# Altium schematic sheet Sensors - RF Module.SchDoc
size A4; SheetNumber: 5; SheetTotal: 5
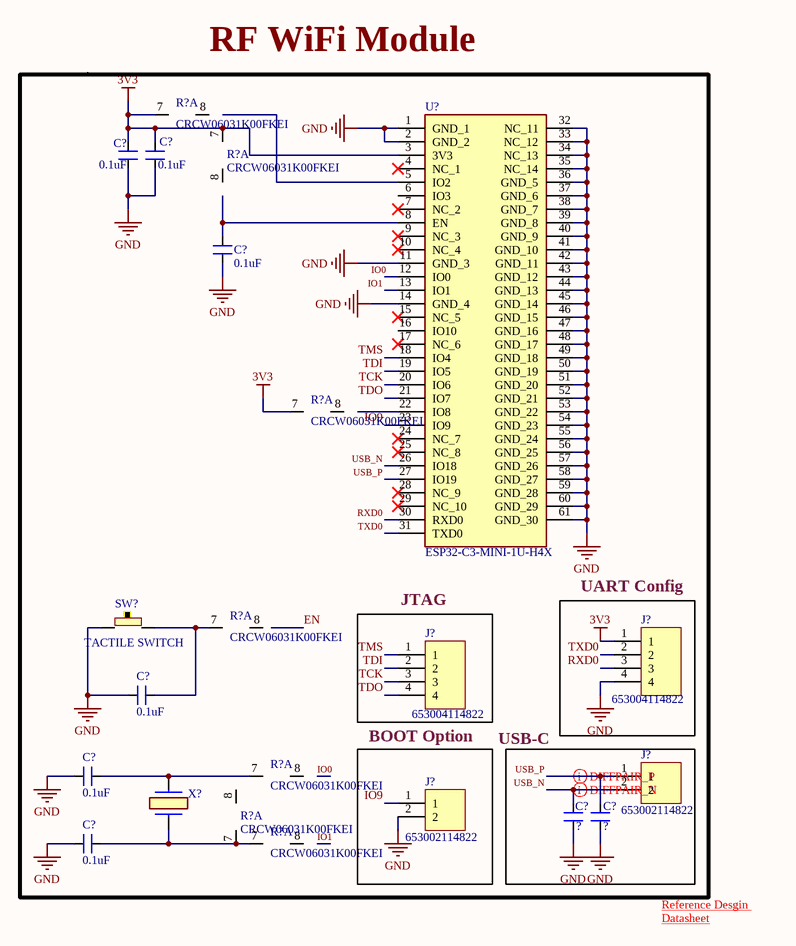
[diagram p0: Sensors - RF Module.SchDoc]

## Parts
(Parts that share a designator on the sheet are numbered #1, #2 ... from top to bottom, then left to right.)
C?#1  0.1uF  [RES_0603]
C?#2  0.1uF  [RES_0603]
C?#3  0.1uF  [RES_0603]
C?#4  0.1uF  [RES_0603]
C?#5  0.1uF  [RES_0603]
C?#6  ?  [RES_0603]
C?#7  ?  [RES_0603]
C?#8  0.1uF  [RES_0603]
J?#1  653004114822  [CON4_50_653004114822_TH_ST]
J?#2  653004114822  [CON4_50_653004114822_TH_ST]
J?#3  653002114822  [CON2_50_653002114822_TH_ST]
J?#4  653002114822  [CON2_50_653002114822_TH_ST]
R?#1  CRCW06031K00FKEI  [RES_0603]  (part A of 2)
R?#2  CRCW06031K00FKEI  [RES_0603]  (part A of 2)
R?#3  CRCW06031K00FKEI  [RES_0603]  (part A of 2)
R?#4  CRCW06031K00FKEI  [RES_0603]  (part A of 2)
R?#5  CRCW06031K00FKEI  [RES_0603]  (part A of 2)
R?#6  CRCW06031K00FKEI  [RES_0603]  (part A of 2)
R?#7  CRCW06031K00FKEI  [RES_0603]  (part A of 2)
SW?  TACTILE SWITCH  [SW_342_SMD]
U?  ESP32-C3-MINI-1U-H4X  [ESP32C3MINI1UH4X]
X?  XT1312HHRXX32K76E  [XT1312HHRXX32K76E]  (value not drawn)

## Blocks framed on the sheet
USB-C: C?#1-C?#8 J?#3 R?#1-R?#7 SW? U? X?
JTAG: J?#2
UART Config: J?#1
BOOT Option: J?#4

## Nets
3V3: C?#1.1 C?#2.2 J?#1.1 R?#1.7 R?#2.7 R?#3.7 U?.3(3V3)
GND: C?#1.2 C?#2.1 C?#3.1 C?#4.1 C?#5.1 C?#6.1 C?#7.1 C?#8.1 J?#1.4 J?#4.2 SW?.1 U?.1(GND_1) U?.2(GND_2) U?.11(GND_3) U?.14(GND_4) U?.32(NC_11) U?.33(NC_12) U?.34(NC_13) U?.35(NC_14) U?.36(GND_5) U?.37(GND_6) U?.38(GND_7) U?.39(GND_8) U?.40(GND_9) U?.41(GND_10) U?.42(GND_11) U?.43(GND_12) U?.44(GND_13) U?.45(GND_14) U?.46(GND_15) U?.47(GND_16) U?.48(GND_17) U?.49(GND_18) U?.50(GND_19) U?.51(GND_20) U?.52(GND_21) U?.53(GND_22) U?.54(GND_23) U?.55(GND_24) U?.56(GND_25) U?.57(GND_26) U?.58(GND_27) U?.59(GND_28) U?.60(GND_29) U?.61(GND_30)
IO1: U?.13(IO1)
IO9: J?#4.1 U?.23(IO9)
RXD0: J?#1.3 U?.30(RXD0)
TCK: J?#2.3 U?.20(IO6)
TDI: J?#2.2 U?.19(IO5)
TDO: J?#2.4 U?.21(IO7)
TMS: J?#2.1 U?.18(IO4)
TXD0: J?#1.2 U?.31(TXD0)
USB_N: C?#6.2 J?#3.2 U?.26(IO18)
USB_P: C?#7.2 J?#3.1 U?.27(IO19)
NetC?#3_2: C?#3.2 U?.8(EN)
NetC?#4_2: C?#4.2 R?#4.7 SW?.2
NetC?#5_2: C?#5.2 R?#5.7 X?.2
NetC?#8_2: C?#8.2 R?#6.7 R?#7.7 X?.1

Not connected (* = marked no-connect by the designer): R?#1 8; R?#2 8; R?#3 8; R?#4 8; R?#5 8; R?#6 8; R?#7 8; U? 4(NC_1)* 5(IO2) 6(IO3) 7(NC_2)* 9(NC_3)* 10(NC_4)* 12(IO0) 15(NC_5)* 16(IO10) 17(NC_6)* 22(IO8) 24(NC_7)* 25(NC_8)* 28(NC_9)* 29(NC_10)*

## Layout directives
differential pair: USB_N, USB_P

## Notes on the sheet
- Reference Desgin <https://docs.espressif.com/projects/esp-hardware-design-guidelines/en/latest/esp32c3/schematic-checklist.html>
- Datasheet <https://documentation.espressif.com/esp32-c3-mini-1_datasheet_en.pdf>
- Labels drawn without touching a wire or pin: IO0, RF WiFi Module

## Library data of the parts
C?#1-C?#8 = CAP_GENERIC_0603_1: Ceramic Capacitor C0G, NP0 0603 (2012 Metric); Manufacturer: Yageo; Manufacturer Part Number: 600F1R0BT250XT; Alternate Part Number-1: NA; Case/Package: 0805; Supplier-1: Mouser; Supplier Part Number-1: 581-600F1R0BT
J?#1 J?#2 = CON-PLG_4X1-50-ST-TH: 4 Pins, 1 Row 1.25mm Pitch, straight Connector, male; Manufacturer: JST; Mating Part Number: 653004113322; Crimp Part Number: 653153128130; Alternate Part Number-1: NA; Manufacturer Part Number: 653004114822; Case/Package: TH-CON; Supplier-1: WURTH; Supplier Part Number-1: 653004114822
J?#3 J?#4 = CON-PLG_2X1-50-ST-TH: 2 Pins, 1 Row 1.25mm Pitch, Straight Connector, male; Manufacturer: JST; Mating Part Number: 653002113322; Crimp Part Number: 653153128130; Alternate Part Number-1: NA; Manufacturer Part Number: 653002114822; Case/Package: TH-CON; Supplier-1: WURTH; Supplier Part Number-1: 653002114822
R?#1-R?#7 = RES_1Kohm_0603: Thick Film Resistors - SMD D11/CRCW0603 100 1K0 1% ET2 E3
SW? = SW1_RS-282G05A3-SMRT-SMD: Tactile Switch SPST-NO Top Actuated Surface Mount; Manufacturer: ITT C&K; Alternate Part Number-1: NA; Manufacturer Part Number: RS-282G05A3-SMRT; Case/Package: SMD; Supplier-1: SP ROAD; Supplier Part Number-1: RS-282G05A3-SMRT
U? = ESP32-C3-MINI-1U-H4X: Bluetooth, WiFi 802.11b/g/n, Bluetooth v5.0 Transceiver Module 2.412GHz ~ 2.484GHz Antenna Not Included, W.FL Surface Mount
X? = XTAL Crystal 32.768KHz: 32.768 kHz +/-20ppm Crystal 12pF 70 kOhms 2-SMD, No Lead , -40C ~ 85C